# Altium schematic sheet SENSE_AMP.SchDoc: Current Sense Amplification
size 431 x 279 mm; Engineer: JGao; Organization: TESLA Motors, INC; Address1: 3500 Deer Creek Road; Address2: Palo Alto, CA; Address4: U.S.A.; Revision: 1.1; SheetNumber: 3; SheetTotal: 3
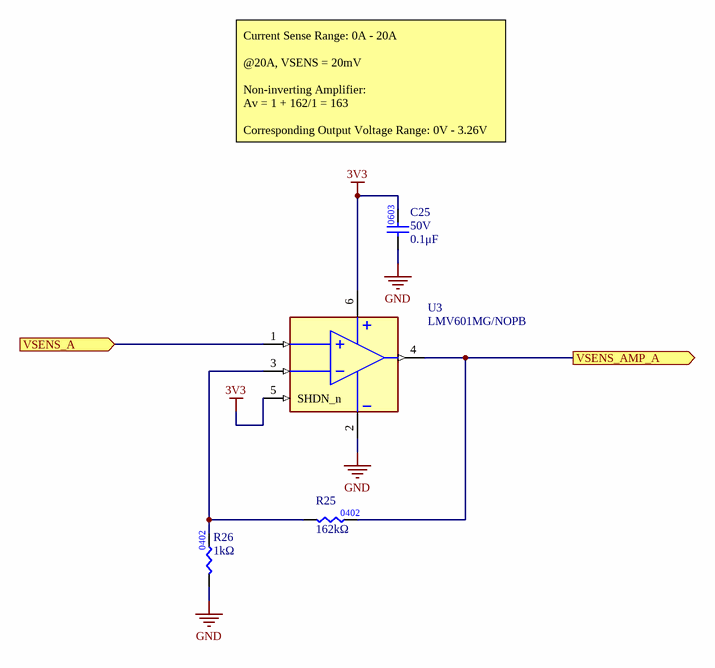
[diagram p0: SENSE_AMP.SchDoc]

## Parts
C25  value 0.1μF  Voltage Rating: 50V  [CAP0603]  (hidden comment: CAP_0.1uF_50V_0603)
R25  value 162kΩ  [RES0402]  (hidden comment: RES_162kΩ_0402_1%)
R26  value 1kΩ  [RES0402]  (hidden comment: RES_1kΩ_0402_1%)
U3  LMV601MG/NOPB  [SOT65P210X110-6N]

## Ports
VSENS_A (in), VSENS_AMP_A (out)

## Nets
3V3: C25.2 U3.5(SHDN_n) U3.6(V+)
GND: C25.1 R26.1 U3.2(GND)
VSENS_A: U3.1(IN+) ; port VSENS_A
VSENS_AMP_A: R25.2 U3.4(OUT) ; port VSENS_AMP_A
NetR25_1: R25.1 R26.2 U3.3(IN-)

## Notes on the sheet
- Current Sense Range: 0A - 20A
  @20A, VSENS = 20mV
  Non-inverting Amplifier:
  Av = 1 + 162/1 = 163
  Corresponding Output Voltage Range: 0V - 3.26V
- University of Waterloo Robotics Team
- 200 University Ave W
- REV
- PROJECT
- Waterloo, Ontario, Canada
- N2L 3G1
- DOCUMENT
- ENGINEER
- REVIEWER
- MODIFIED
- SHEET
- OF

## Library data of the parts
C25 = CAP_0.1uF_50V_0603: CAP CER 0.1UF 50V X7R 0603; Manufacturer Part Number 1: CC0603KRX7R9BB104; Manufacturer 1: Yageo; Package/Footprint: 0603; Supplier Part Number 1: 311-1344-1-ND; Supplier 1: Digi-Key; Mounting Type: SMD; Dielectric: X7R
R25 = RES_162kΩ_0402_1%: RES 162K OHM 1% 1/16W 0402; Manufacturer Part Number 1: RMCF0402FT162K; Manufacturer 1: Panasonic Electronic Components; Power: 0.063W, 1/16W; Package/Footprint: 0402; Supplier 1: Digi-Key; Supplier Part Number 1: RMCF0402FT162KCT-ND; Mounting Type: SMD; Tolerance: 1%
R26 = RES_1kΩ_0402_1%: RES 1K OHM 1% 1/16W 0402; Manufacturer 1: Stackpole Electronics; Manufacturer Part Number 1: RMCF0402FT1K00; Supplier 1: Digi-Key; Supplier Part Number 1: RMCF0402FT1K00CT-ND; Tolerance: 1%; Package: 0402
U3 = IC_OPAMP_GP: IC OPAMP GP 1 CIRCUIT SC70-6; Manufacturer: Texas Instruments; Ratings: 2.7-5.5V, -25-125degC, 1MHz; Manufacturer Part Number: LMV601MG/NOPB; Value: LMV601MG/NOPB